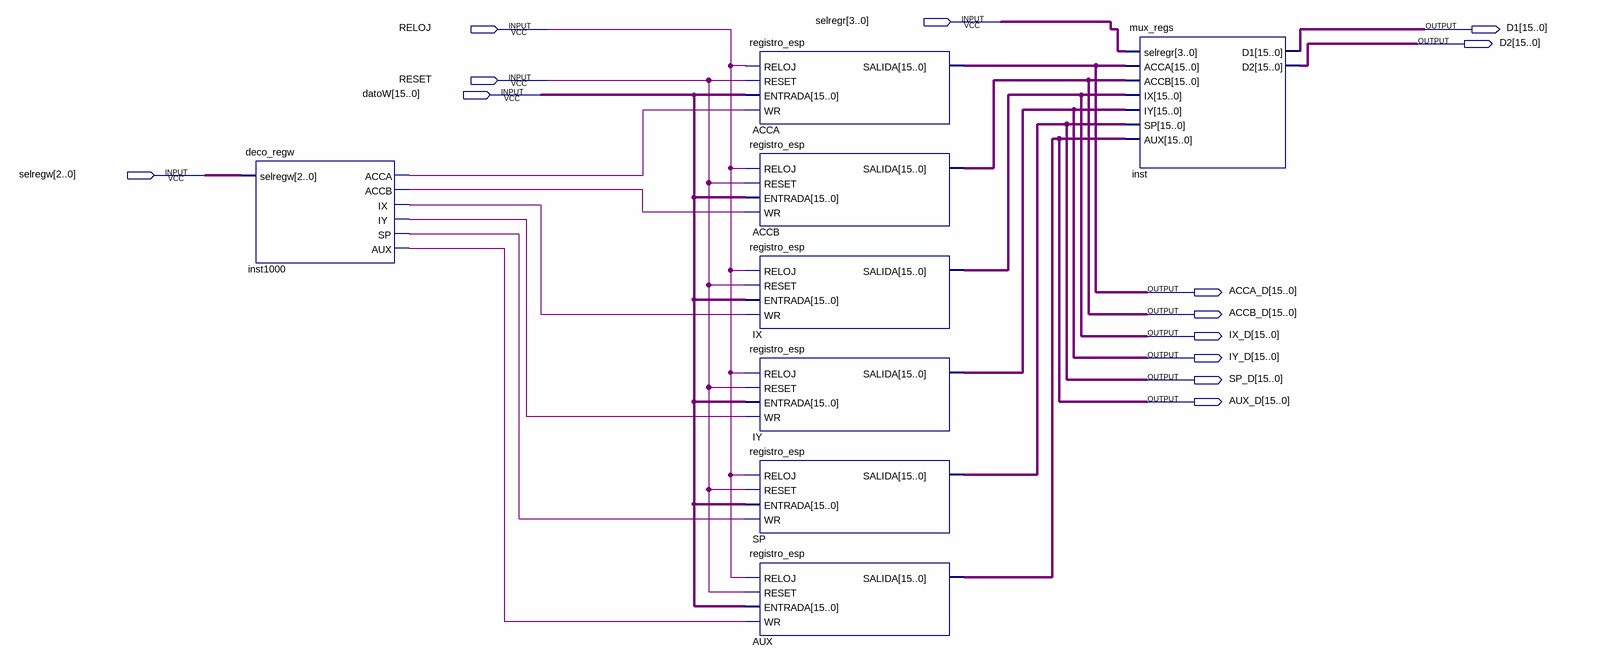
[diagram p0: schematic sheet]
// Quartus schematic registros.bdf as structural Verilog: 8 symbols, 13 pins
module registros (
  input  [3:0] selregr,
  input  RELOJ,
  input  RESET,
  input  [15:0] datoW,
  input  [2:0] selregw,
  output [15:0] D1,
  output [15:0] D2,
  output [15:0] ACCA_D,
  output [15:0] ACCB_D,
  output [15:0] IX_D,
  output [15:0] IY_D,
  output [15:0] SP_D,
  output [15:0] AUX_D
);

  wire inst1000_acca, inst1000_accb, inst1000_aux, inst1000_ix, inst1000_iy, inst1000_sp;

  deco_regw inst1000 (
    .selregw(selregw), .ACCA(inst1000_acca), .ACCB(inst1000_accb), .IX(inst1000_ix), .IY(inst1000_iy),
    .SP(inst1000_sp), .AUX(inst1000_aux));
  registro_esp ACCA (.RELOJ(RELOJ), .RESET(RESET), .ENTRADA(datoW), .WR(inst1000_acca), .SALIDA(ACCA_D));
  registro_esp ACCB (.RELOJ(RELOJ), .RESET(RESET), .ENTRADA(datoW), .WR(inst1000_accb), .SALIDA(ACCB_D));
  registro_esp IX (.RELOJ(RELOJ), .RESET(RESET), .ENTRADA(datoW), .WR(inst1000_ix), .SALIDA(IX_D));
  registro_esp IY (.RELOJ(RELOJ), .RESET(RESET), .ENTRADA(datoW), .WR(inst1000_iy), .SALIDA(IY_D));
  registro_esp SP (.RELOJ(RELOJ), .RESET(RESET), .ENTRADA(datoW), .WR(inst1000_sp), .SALIDA(SP_D));
  registro_esp AUX (.RELOJ(RELOJ), .RESET(RESET), .ENTRADA(datoW), .WR(inst1000_aux), .SALIDA(AUX_D));
  mux_regs inst (
    .selregr(selregr), .ACCA(ACCA_D), .ACCB(ACCB_D), .IX(IX_D), .IY(IY_D), .SP(SP_D), .AUX(AUX_D), .D1(D1),
    .D2(D2));
endmodule
